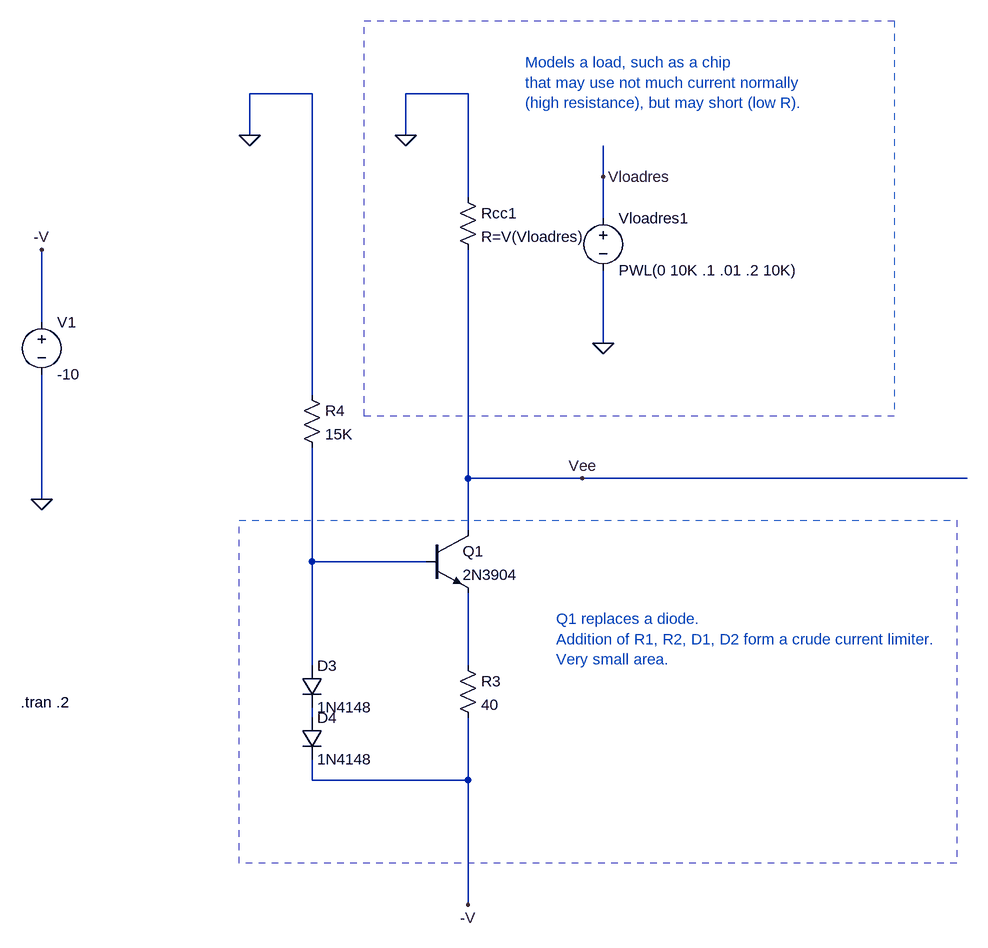
[diagram p0: schematic NegSupplyLimit.asc]
NegSupplyLimit.asc, the LTspice schematic file:
Version 4
SHEET 1 2428 1332
WIRE 48 -304 -48 -304
WIRE 288 -304 192 -304
WIRE -48 -240 -48 -304
WIRE 192 -240 192 -304
WIRE 496 -176 496 -224
WIRE 288 -144 288 -304
WIRE 496 -112 496 -176
WIRE -368 48 -368 -64
WIRE 496 80 496 -32
WIRE 48 160 48 -304
WIRE 288 288 288 -64
WIRE 464 288 288 288
WIRE 1056 288 464 288
WIRE -368 320 -368 128
WIRE 288 368 288 288
WIRE 48 416 48 240
WIRE 224 416 48 416
WIRE 48 576 48 416
WIRE 288 576 288 464
WIRE 48 656 48 640
WIRE 48 752 48 720
WIRE 288 752 288 656
WIRE 288 752 48 752
WIRE 288 944 288 752
FLAG -368 320 0
FLAG -368 -64 -V
FLAG 288 944 -V
FLAG -48 -240 0
FLAG 496 -176 Vloadres
FLAG 192 -240 0
FLAG 496 80 0
FLAG 464 288 Vee
SYMBOL voltage -368 32 R0
WINDOW 123 0 0 Left 2
WINDOW 39 0 0 Left 2
SYMATTR InstName V1
SYMATTR Value -10
SYMBOL res 272 560 R0
SYMATTR InstName R3
SYMATTR Value 40
SYMBOL diode 32 576 R0
SYMATTR InstName D3
SYMATTR Value 1N4148
SYMBOL diode 32 656 R0
SYMATTR InstName D4
SYMATTR Value 1N4148
SYMBOL npn 224 368 R0
SYMATTR InstName Q1
SYMATTR Value 2N3904
SYMBOL res 32 144 R0
SYMATTR InstName R4
SYMATTR Value 15K
SYMBOL res 272 -160 R0
SYMATTR InstName Rcc1
SYMATTR Value R=V(Vloadres)
SYMBOL voltage 496 -128 R0
WINDOW 123 0 0 Left 2
WINDOW 39 0 0 Left 2
SYMATTR InstName Vloadres1
SYMATTR Value PWL(0 10K .1 .01 .2 10K)
TEXT -400 632 Left 2 !.tran .2
TEXT 424 504 Left 2 ;Q1 replaces a diode.\nAddition of R1, R2, D1, D2 form a crude current limiter.\nVery small area.
TEXT 376 -352 Left 2 ;Models a load, such as a chip\nthat may use not much current normally \n(high resistance), but may short (low R).
RECTANGLE Normal 1040 880 -64 352 2
RECTANGLE Normal 944 192 128 -416 2

The netlist it stands for:
* NegSupplyLimit.asc
V1 -V 0 -10
R3 N002 -V 40
D3 N001 N003 1N4148
D4 N003 -V 1N4148
Q1 Vee N001 N002 0 2N3904
R4 0 N001 15K
Rcc1 0 Vee R=V(Vloadres)
Vloadres1 Vloadres 0 PWL(0 10K .1 .01 .2 10K)
.model D D
.lib standard.dio
.model NPN NPN
.model PNP PNP
.lib standard.bjt
.tran .2
* Q1 replaces a diode.
* Addition of R1, R2, D1, D2 form a crude current limiter.
* Very small area.
* Models a load, such as a chip
* that may use not much current normally
* (high resistance), but may short (low R).
.backanno
.end